# Altium schematic sheet Mechanical.SchDoc: Titel
size A3; DesignedDate: 01-01-12; CompanyName: DCI Electronics bv; DrawnBy: KRS; Organization: DCI Electronics; Address1: Nijverheidsstraat 14; Address2: 4458 AV Eindewege; Address3: Phone: +31 (0)113 344880; DocumentNumber: 0; Revision: 0; SheetNumber: 14; SheetTotal: 14; PageSetup: Record=PageOptions|CenterHorizontal=True|CenterVertical=True|PrintScale=1.00|XCorrection=1.00|YCorrection=1.00|PrintKind=1|BorderSize=5000000|LeftOffset=0|BottomOffset=0|Orientation=2|PaperLength=1000|PaperWidth=1000|Scale=100|PaperSource=7|PrintQuality=-4|MediaType=1|DitherType=10|PaperKind=ISO_A4_(210.00_x_297.00_MM)|PrintScaleMode=1; SubTitle: SubTitel; ApprovedDate: 01-01-12
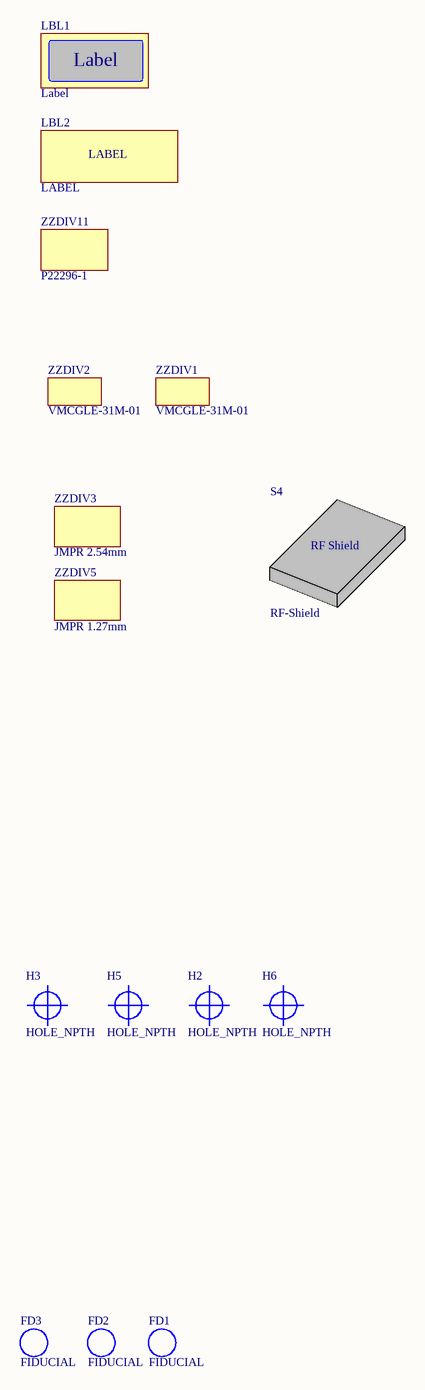
[diagram p0: Mechanical.SchDoc]

## Parts
FD1  FIDUCIAL  [fiducial1.5MM]
FD2  FIDUCIAL  [fiducial1.5MM]
FD3  FIDUCIAL  [fiducial1.5MM]
H2  HOLE_NPTH  [NPTH_3.0]  (no BOM)
H3  HOLE_NPTH  [NPTH_3.0]  (no BOM)
H5  HOLE_NPTH  [NPTH_3.0]  (no BOM)
H6  HOLE_NPTH  [NPTH_SLOT_3.0_6.0]  (no BOM)
LBL1  Label  [LABEL_12.7X25.4]
LBL2  LABEL  [Label_5x15]  (no BOM)
S4  RF-Shield  (mechanical)
ZZDIV1  VMCGLE-31M-01  [ADD-903000-001]
ZZDIV2  VMCGLE-31M-01  [ADD-903000-001]
ZZDIV3  JMPR 2.54mm  (mechanical)
ZZDIV5  JMPR 1.27mm  (mechanical)
ZZDIV11  P22296-1  (mechanical)

## Notes on the sheet
- Designed by:
- Drawing number:
- Variant:
- Date:
- Page:
- Rev:
- Of:
- Dekimo Goes B.V.
- Nijverheidsstraat 14, 4458 AV  Eindewege, Phone: +31 (0)113 344880
- (in symbol MEC SHIELD/2) RF Shield

## Library data of the parts
LBL1 = LBL STCK/20: Multi-funct labels12.7 x25.4mm; EngPartGrpMainCode: CASE; SMD_Flag: False; PartCode: LBL STCK/20; Type: Standard Label; ManufactpartCode: -; Preferred: False
LBL2 = LABEL: Production Label; PartCode: LABEL
S4 = MEC SHIELD/2: PCB SMD shield cap; Manufacturer: Masach Tech; Manufacturer_Part_Number: MS409-10; EngPartGrpMainCode: MEC; ManufactpartCode: 2118717-2-TEC; Preferred: False; PartCode: MEC SHIELD/2; Type: Various PCB Components; SMD_Flag: False
ZZDIV1 ZZDIV2 = MEC PCBGUIDE/2: Vertical card guide 30mm; EngPartGrpMainCode: MEC; ManufactpartCode: VMCGLE-31M-01-ESS; Preferred: False; PartCode: MEC PCBGUIDE/2; Type: Various; SMD_Flag: False
ZZDIV3 = DIV JMPR/6: Jumper 2.54; EngPartGrpMainCode: CONN; ManufactpartCode: 0-142270-1; Remark: J24; Preferred: False; PartCode: DIV JMPR/6; Type: Jumper; SMD_Flag: False
ZZDIV5 = DIV JMPR/9: SN,HANDGR,W2.5,,H3,D1.27; EngPartGrpMainCode: CONN; ManufactpartCode: M50-1900005-HAR; Remark: J11 1-2; Preferred: False; PartCode: DIV JMPR/9; Type: Jumper; SMD_Flag: False
ZZDIV11 = PCB P22296-1: MFM Basis; EngPartGrpMainCode: PCB; Preferred: False; PartCode: PCB P22296-1; Type: $PCB; ManufactpartCode: P22296-1; SMD_Flag: False